# EAGLE design qo-100-opi-control-hat (EAGLE 9.6.1)
CNAME: None; CREVISION: 1; DESIGNER: Joao Silva

## Sheet 1 of 3: SBC
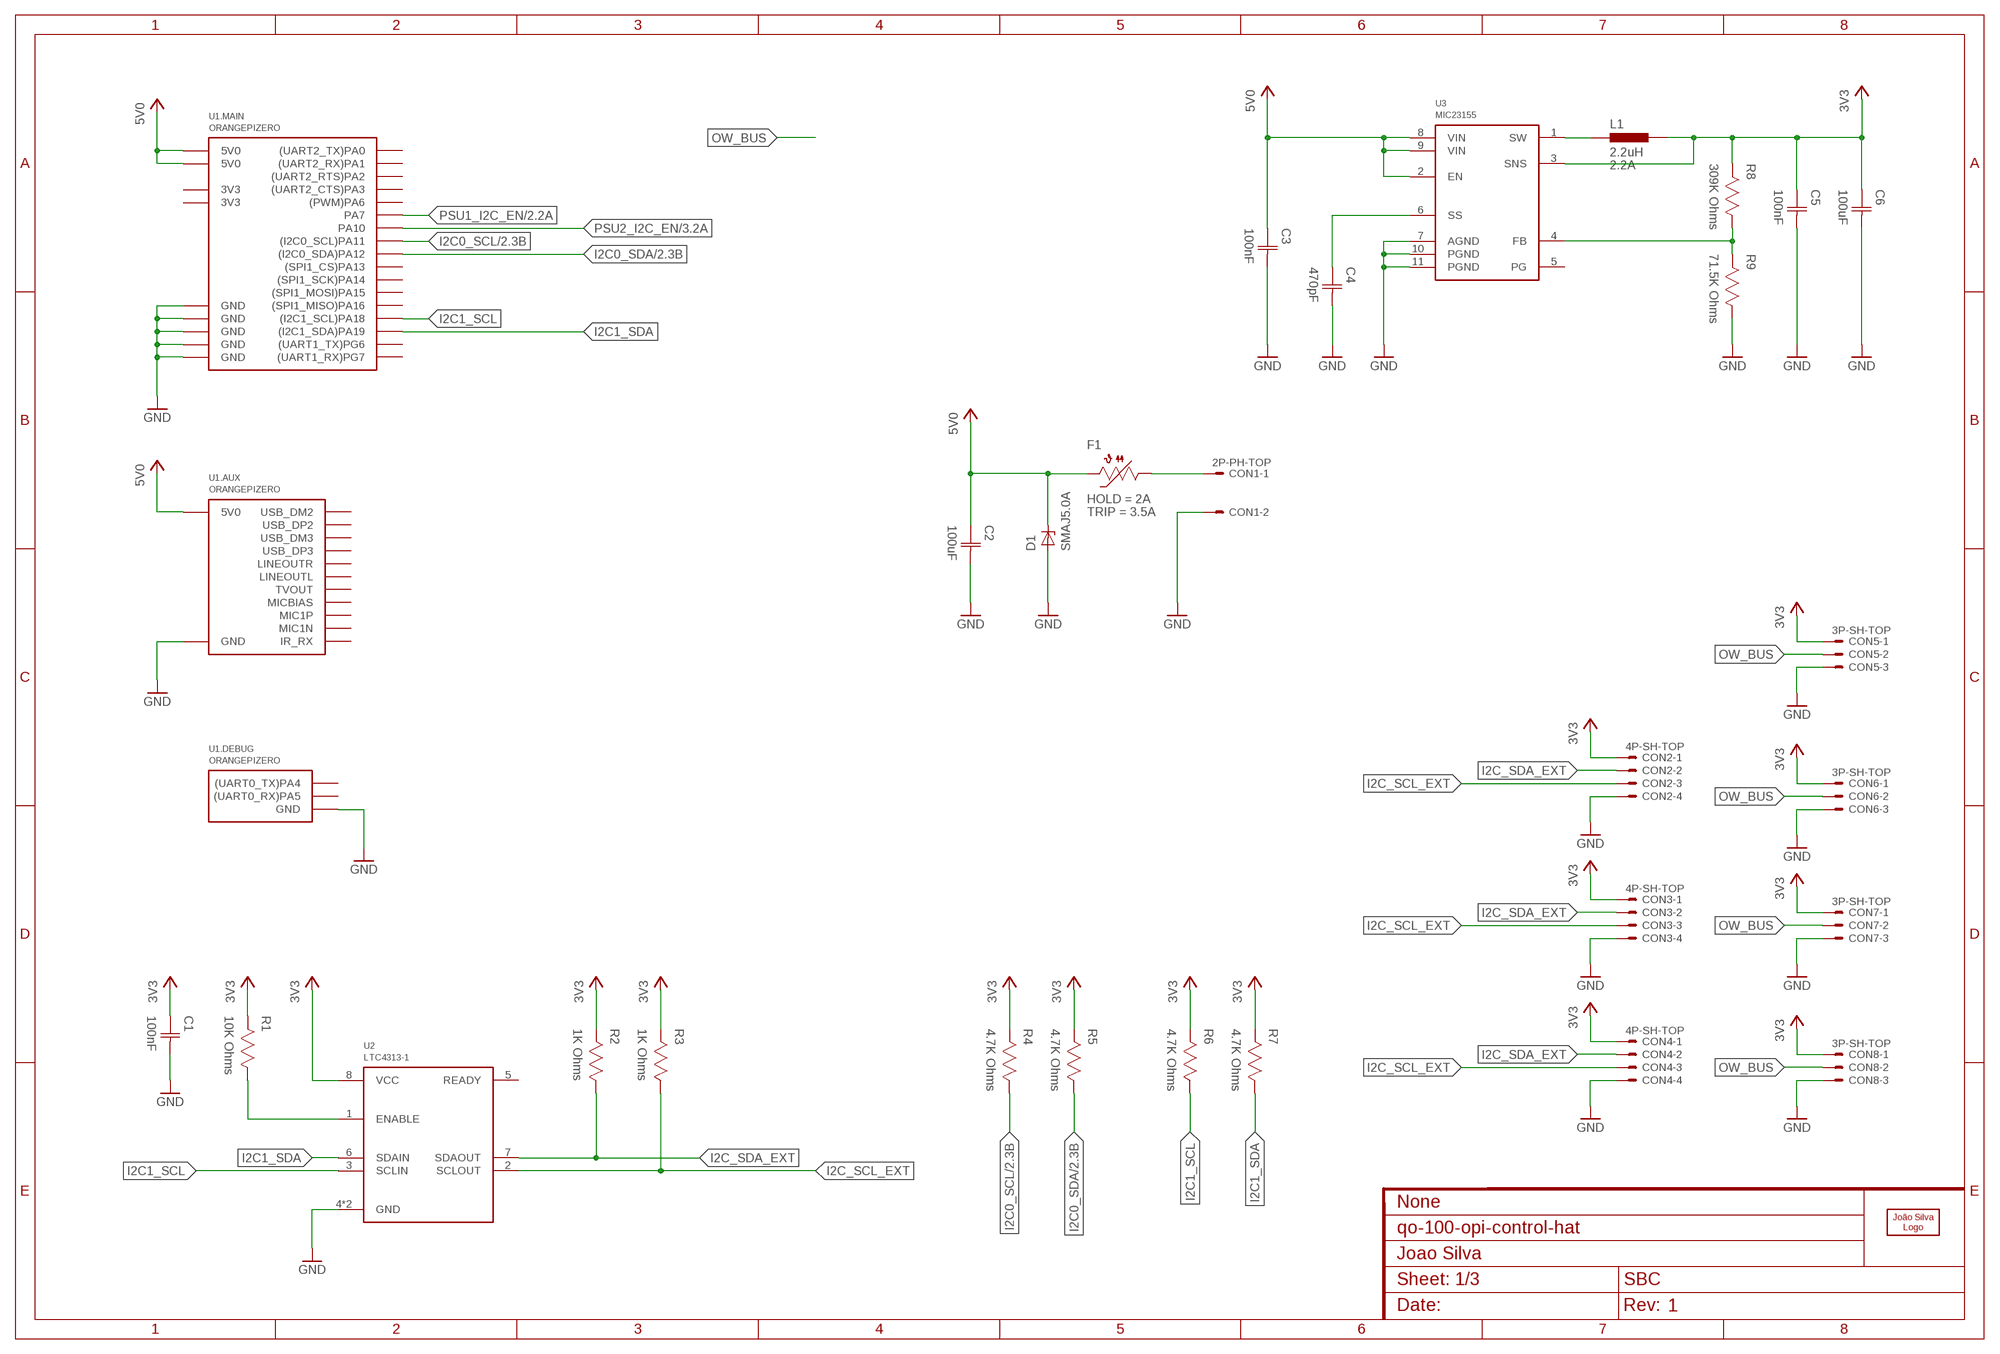
[diagram p0: schematic, sheet 1]

### Parts
C1  100nF  CAPACITOR-0603  [CAP0603]
C2  100uF  CAPACITOR-1206  [CAP1206]
C3  100nF  CAPACITOR-0603  [CAP0603]
C4  470pF  CAPACITOR-0603  [CAP0603]
C5  100nF  CAPACITOR-0603  [CAP0603]
C6  100uF  CAPACITOR-1206  [CAP1206]
CON1  2P-PH-TOP  [PH-02-TOP]
CON2  4P-SH-TOP  [SH-04-TOP]
CON3  4P-SH-TOP  [SH-04-TOP]
CON4  4P-SH-TOP  [SH-04-TOP]
CON5  3P-SH-TOP  [SH-03-TOP]
CON6  3P-SH-TOP  [SH-03-TOP]
CON7  3P-SH-TOP  [SH-03-TOP]
CON8  3P-SH-TOP  [SH-03-TOP]
D1  SMAJ5.0A  [DO214AC]
F1  PTC1206  [1206]
L1  2.2uH  INDUCTOR-2.5X2X1.2MM  [IND2520]
LOGO1  JS-5MM  [JS_5MM]
R1  10K Ohms  RESISTOR-0603  [RES0603]
R2  1K Ohms  RESISTOR-0603  [RES0603]
R3  1K Ohms  RESISTOR-0603  [RES0603]
R4  4.7K Ohms  RESISTOR-0603  [RES0603]
R5  4.7K Ohms  RESISTOR-0603  [RES0603]
R6  4.7K Ohms  RESISTOR-0603  [RES0603]
R7  4.7K Ohms  RESISTOR-0603  [RES0603]
R8  309K Ohms  RESISTOR-0603  [RES0603]
R9  71.5K Ohms  RESISTOR-0603  [RES0603]
U1  ORANGEPIZERO  [ORANGEPIZERO]
U2  LTC4313-1  [DFN8]
U3  MIC23155  [DFN10]

### Nets
3V3: C1.1(C1) C5.1(C1) C6.1(C1) CON2.1 CON3.1 CON4.1 CON5.1 CON6.1 CON7.1 CON8.1 L1.2 R1.2 R2.2 R3.2 R4.2 R5.2 R6.2 R7.2 R8.2 U2.8(VCC) U3.3(SNS) ; also sheet 2,3
3V3_FB: R8.1 R9.2 U3.4(FB)
3V3_SOFTSTART: C4.1(C1) U3.6(SS)
3V3_SW: L1.1 U3.1(SW)
5V0: C2.1(C1) C3.1(C1) D1.C F1.2 U1.MH$2(.MAIN:5V0) U1.MH$4(.MAIN:5V0) U1.SH$1(.AUX:5V0) U3.2(EN) U3.8(VIN) U3.9(VIN)
GND: C1.2(C2) C2.2(C2) C3.2(C2) C4.2(C2) C5.2(C2) C6.2(C2) CON1.2 CON2.4 CON3.4 CON4.4 CON5.3 CON6.3 CON7.3 CON8.3 D1.A R9.1 U1.DBG$1(.DEBUG:GND) U1.MH$6(.MAIN:GND) U1.MH$9(.MAIN:GND) U1.MH$14(.MAIN:GND) U1.MH$20(.MAIN:GND) U1.MH$25(.MAIN:GND) U1.SH$2(.AUX:GND) U2.4(GND) U2.9(GND) U3.7(AGND) U3.10(PGND) U3.11(PGND) ; also sheet 2,3
I2C0_SCL: R4.1 U1.MH$5(.MAIN:(I2C0_SCL)PA11) ; also sheet 2,3
I2C0_SDA: R5.1 U1.MH$3(.MAIN:(I2C0_SDA)PA12) ; also sheet 2,3
I2C1_SCL: R6.1 U1.MH$18(.MAIN:(I2C1_SCL)PA18) U2.3(SCLIN)
I2C1_SDA: R7.1 U1.MH$16(.MAIN:(I2C1_SDA)PA19) U2.6(SDAIN)
I2C_SCL_EXT: CON2.3 CON3.3 CON4.3 R3.1 U2.2(SCLOUT)
I2C_SDA_EXT: CON2.2 CON3.2 CON4.2 R2.1 U2.7(SDAOUT)
N$12: CON1.1 F1.1
N$13: R1.1 U2.1(ENABLE)
OW_BUS: CON5.2 CON6.2 CON7.2 CON8.2
PSU1_I2C_EN: U1.MH$12(.MAIN:PA7) ; also sheet 2
PSU2_I2C_EN: U1.MH$26(.MAIN:PA10) ; also sheet 3
Unconnected: U1.DBG$2(.DEBUG:(UART0_RX)PA5) U1.DBG$3(.DEBUG:(UART0_TX)PA4) U1.MH$1(.MAIN:3V3) U1.MH$7(.MAIN:(PWM)PA6) U1.MH$8(.MAIN:(UART1_TX)PG6) U1.MH$10(.MAIN:(UART1_RX)PG7) U1.MH$11(.MAIN:(UART2_RX)PA1) U1.MH$13(.MAIN:(UART2_TX)PA0) U1.MH$15(.MAIN:(UART2_CTS)PA3) U1.MH$17(.MAIN:3V3) U1.MH$19(.MAIN:(SPI1_MOSI)PA15) U1.MH$21(.MAIN:(SPI1_MISO)PA16) U1.MH$22(.MAIN:(UART2_RTS)PA2) U1.MH$23(.MAIN:(SPI1_SCK)PA14) U1.MH$24(.MAIN:(SPI1_CS)PA13) U1.SH$3(.AUX:USB_DM2) U1.SH$4(.AUX:USB_DP2) U1.SH$5(.AUX:USB_DM3) U1.SH$6(.AUX:USB_DP3) U1.SH$7(.AUX:LINEOUTR) U1.SH$8(.AUX:LINEOUTL) U1.SH$9(.AUX:TVOUT) U1.SH$10(.AUX:MICBIAS) U1.SH$11(.AUX:MIC1P) U1.SH$12(.AUX:MIC1N) U1.SH$13(.AUX:IR_RX) U2.5(READY) U3.5(PG)

## Sheet 2 of 3: PSU #1 Interface
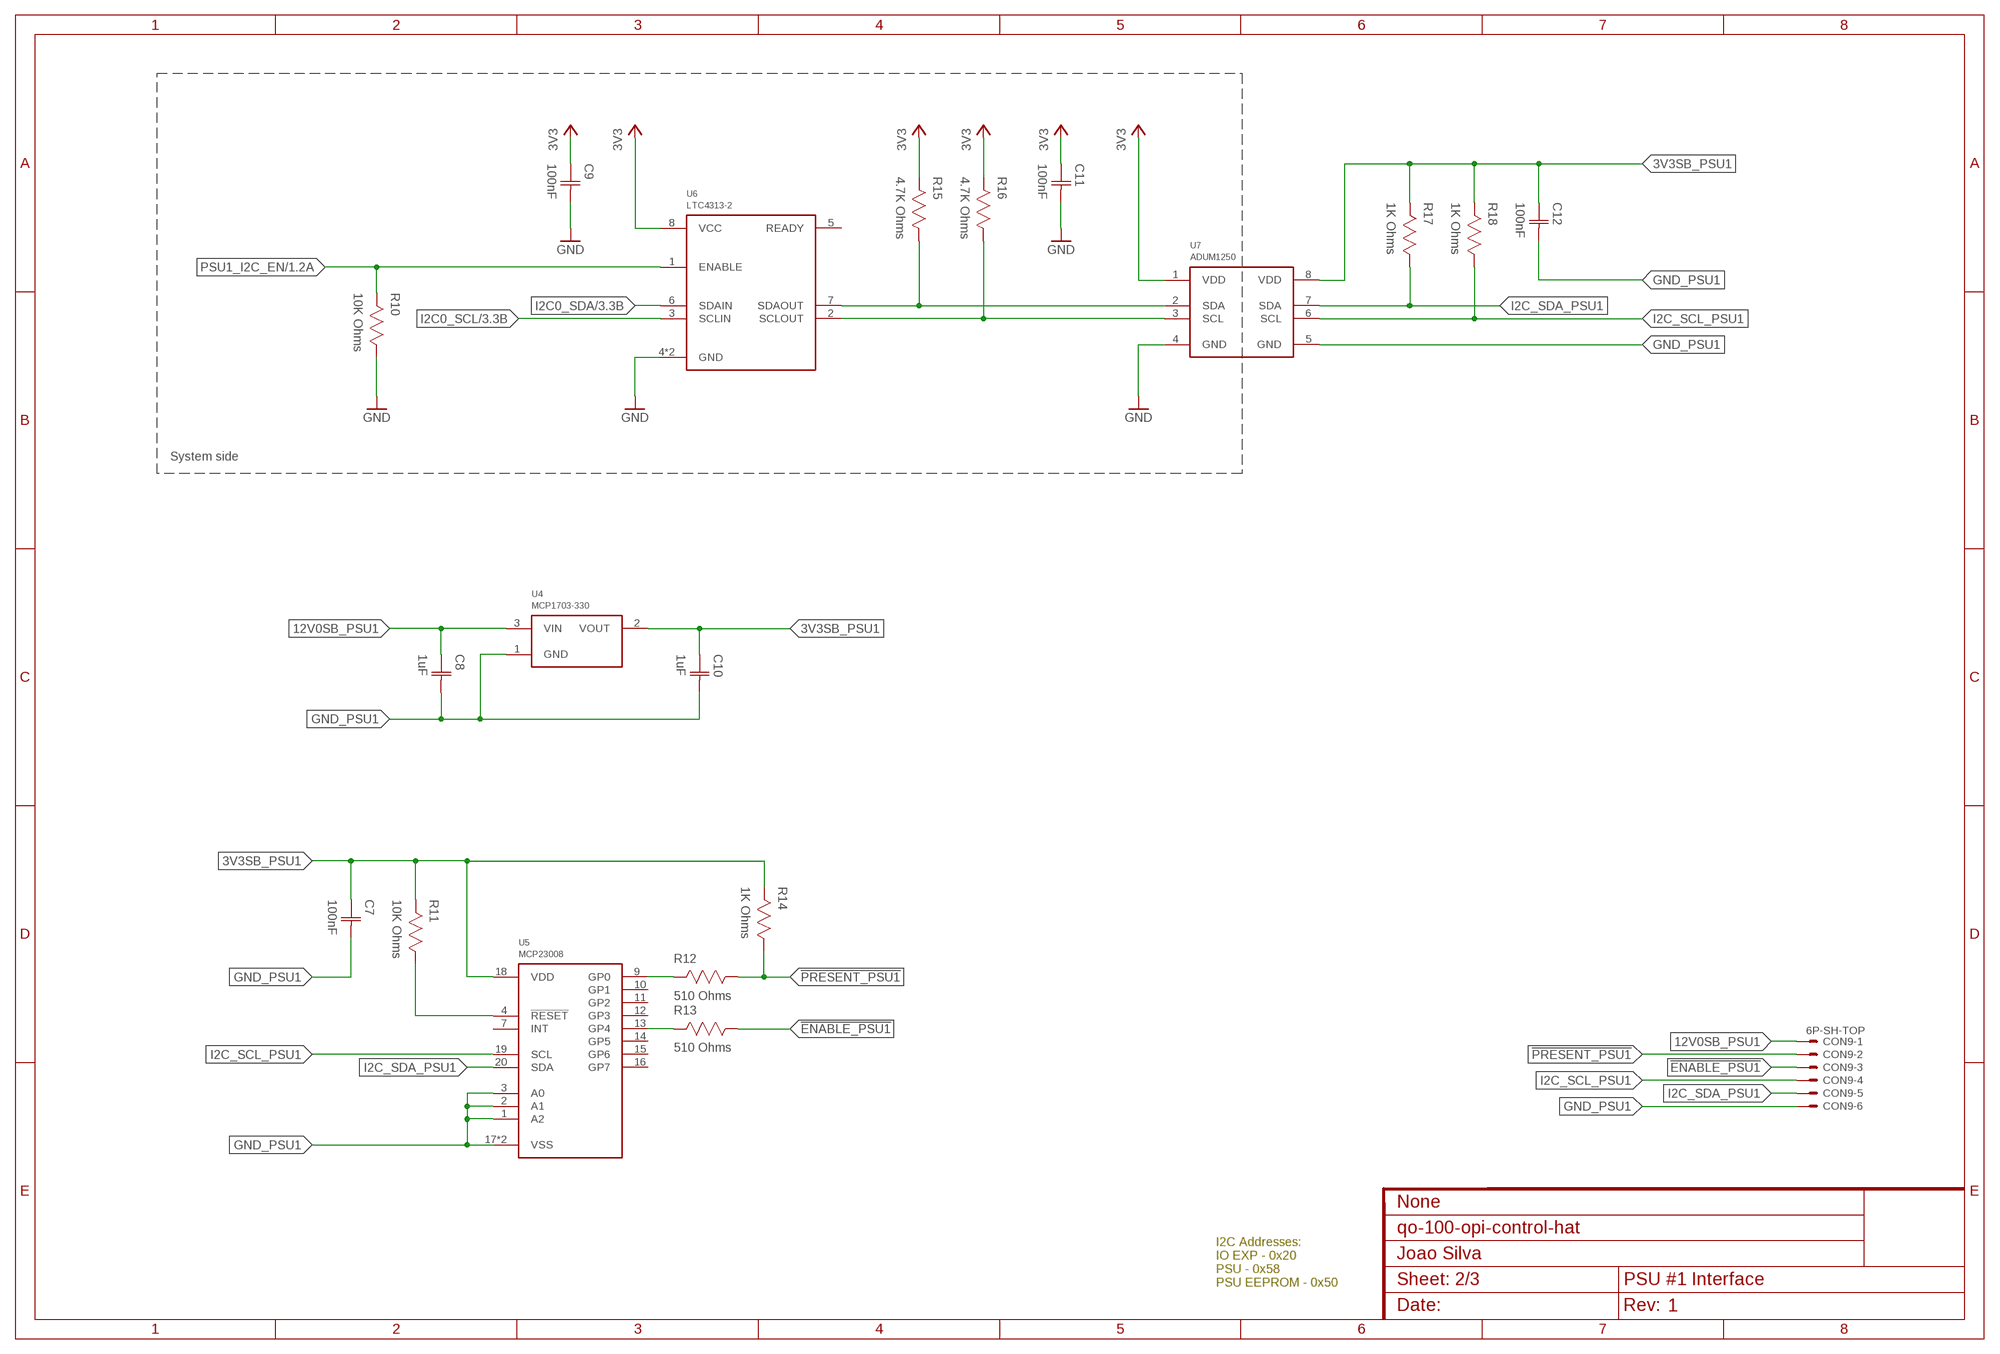
[diagram p1: schematic, sheet 2]

### Parts
C7  100nF  CAPACITOR-0603  [CAP0603]
C8  1uF  CAPACITOR-0603  [CAP0603]
C9  100nF  CAPACITOR-0603  [CAP0603]
C10  1uF  CAPACITOR-0603  [CAP0603]
C11  100nF  CAPACITOR-0603  [CAP0603]
C12  100nF  CAPACITOR-0603  [CAP0603]
CON9  6P-SH-TOP  [SH-06-TOP]
R10  10K Ohms  RESISTOR-0603  [RES0603]
R11  10K Ohms  RESISTOR-0603  [RES0603]
R12  510 Ohms  RESISTOR-0603  [RES0603]
R13  510 Ohms  RESISTOR-0603  [RES0603]
R14  1K Ohms  RESISTOR-0603  [RES0603]
R15  4.7K Ohms  RESISTOR-0603  [RES0603]
R16  4.7K Ohms  RESISTOR-0603  [RES0603]
R17  1K Ohms  RESISTOR-0603  [RES0603]
R18  1K Ohms  RESISTOR-0603  [RES0603]
U4  MCP1703-330  [SOT23]
U5  MCP23008  [QFN20]
U6  LTC4313-2  [DFN8]
U7  ADUM1250  [SOIC8]

### Nets
3V3: C9.1(C1) C11.1(C1) R15.2 R16.2 U6.8(VCC) U7.1(VDD) ; also sheet 1,3
3V3SB_PSU1: C7.1(C1) C10.1(C1) C12.1(C1) R11.2 R14.2 R17.2 R18.2 U4.2(VOUT) U5.18(VDD) U7.8(VDD)
12V0SB_PSU1: C8.1(C1) CON9.1 U4.3(VIN)
!ENABLE_PSU1: CON9.3 R13.1
!PRESENT_PSU1: CON9.2 R12.1 R14.1
GND: C9.2(C2) C11.2(C2) R10.1 U6.4(GND) U6.9(GND) U7.4(GND) ; also sheet 1,3
GND_PSU1: C7.2(C2) C8.2(C2) C10.2(C2) C12.2(C2) CON9.6 U4.1(GND) U5.1(A2) U5.2(A1) U5.3(A0) U5.17(VSS) U5.PAD(VSS) U7.5(GND)
I2C0_SCL: U6.3(SCLIN) ; also sheet 1,3
I2C0_SDA: U6.6(SDAIN) ; also sheet 1,3
I2C_SCL_PSU1: CON9.4 R18.1 U5.19(SCL) U7.6(SCL)
I2C_SDA_PSU1: CON9.5 R17.1 U5.20(SDA) U7.7(SDA)
N$1: R16.1 U6.2(SCLOUT) U7.3(SCL)
N$2: R15.1 U6.7(SDAOUT) U7.2(SDA)
N$3: R11.1 U5.4(!RESET)
N$4: R13.2 U5.13(GP4)
N$5: R12.2 U5.9(GP0)
PSU1_I2C_EN: R10.2 U6.1(ENABLE) ; also sheet 1
Unconnected: U5.7(INT) U5.10(GP1) U5.11(GP2) U5.12(GP3) U5.14(GP5) U5.15(GP6) U5.16(GP7) U6.5(READY)

### Notes on the sheet
- System side
- I2C Addresses:
  IO EXP - 0x20
  PSU - 0x58
  PSU EEPROM - 0x50

## Sheet 3 of 3: PSU #2 Interface
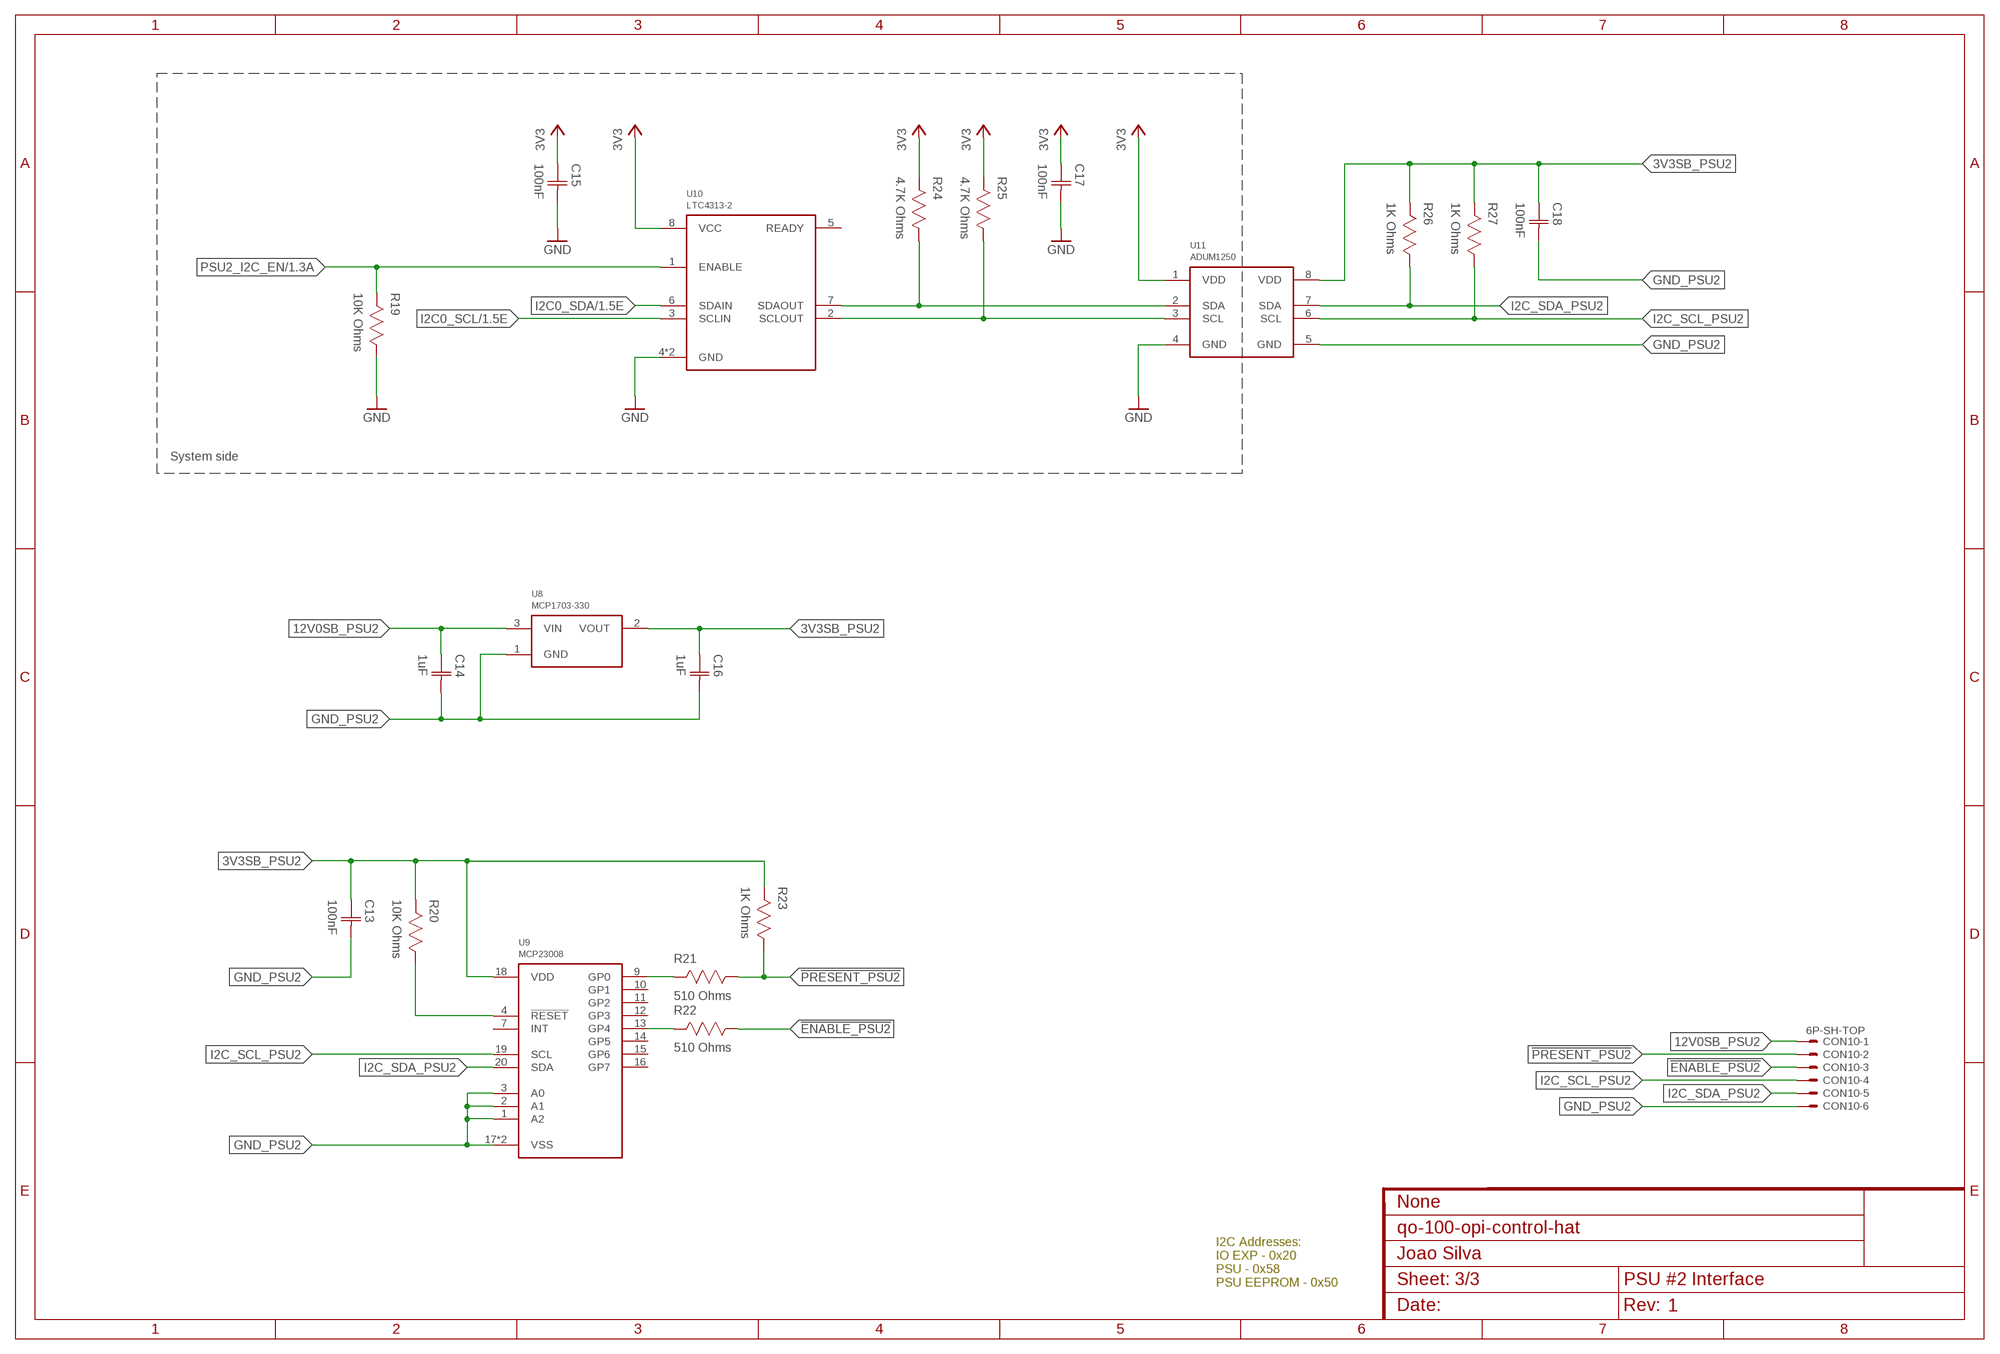
[diagram p2: schematic, sheet 3]

### Parts
C13  100nF  CAPACITOR-0603  [CAP0603]
C14  1uF  CAPACITOR-0603  [CAP0603]
C15  100nF  CAPACITOR-0603  [CAP0603]
C16  1uF  CAPACITOR-0603  [CAP0603]
C17  100nF  CAPACITOR-0603  [CAP0603]
C18  100nF  CAPACITOR-0603  [CAP0603]
CON10  6P-SH-TOP  [SH-06-TOP]
R19  10K Ohms  RESISTOR-0603  [RES0603]
R20  10K Ohms  RESISTOR-0603  [RES0603]
R21  510 Ohms  RESISTOR-0603  [RES0603]
R22  510 Ohms  RESISTOR-0603  [RES0603]
R23  1K Ohms  RESISTOR-0603  [RES0603]
R24  4.7K Ohms  RESISTOR-0603  [RES0603]
R25  4.7K Ohms  RESISTOR-0603  [RES0603]
R26  1K Ohms  RESISTOR-0603  [RES0603]
R27  1K Ohms  RESISTOR-0603  [RES0603]
U8  MCP1703-330  [SOT23]
U9  MCP23008  [QFN20]
U10  LTC4313-2  [DFN8]
U11  ADUM1250  [SOIC8]

### Nets
3V3: C15.1(C1) C17.1(C1) R24.2 R25.2 U10.8(VCC) U11.1(VDD) ; also sheet 1,2
3V3SB_PSU2: C13.1(C1) C16.1(C1) C18.1(C1) R20.2 R23.2 R26.2 R27.2 U8.2(VOUT) U9.18(VDD) U11.8(VDD)
12V0SB_PSU2: C14.1(C1) CON10.1 U8.3(VIN)
!ENABLE_PSU2: CON10.3 R22.1
!PRESENT_PSU2: CON10.2 R21.1 R23.1
GND: C15.2(C2) C17.2(C2) R19.1 U10.4(GND) U10.9(GND) U11.4(GND) ; also sheet 1,2
GND_PSU2: C13.2(C2) C14.2(C2) C16.2(C2) C18.2(C2) CON10.6 U8.1(GND) U9.1(A2) U9.2(A1) U9.3(A0) U9.17(VSS) U9.PAD(VSS) U11.5(GND)
I2C0_SCL: U10.3(SCLIN) ; also sheet 1,2
I2C0_SDA: U10.6(SDAIN) ; also sheet 1,2
I2C_SCL_PSU2: CON10.4 R27.1 U9.19(SCL) U11.6(SCL)
I2C_SDA_PSU2: CON10.5 R26.1 U9.20(SDA) U11.7(SDA)
N$6: R25.1 U10.2(SCLOUT) U11.3(SCL)
N$7: R24.1 U10.7(SDAOUT) U11.2(SDA)
N$8: R20.1 U9.4(!RESET)
N$9: R22.2 U9.13(GP4)
N$10: R21.2 U9.9(GP0)
PSU2_I2C_EN: R19.2 U10.1(ENABLE) ; also sheet 1
Unconnected: U9.7(INT) U9.10(GP1) U9.11(GP2) U9.12(GP3) U9.14(GP5) U9.15(GP6) U9.16(GP7) U10.5(READY)

### Notes on the sheet
- System side
- I2C Addresses:
  IO EXP - 0x20
  PSU - 0x58
  PSU EEPROM - 0x50

## Library data of the parts
C1-C18 = Capacitor:CAPACITOR
CON1 = JST:2P: Disconnectable Crimp style connector, 1.0mm pitch 2 contacts
CON2-CON4 = JST:4P: Disconnectable Crimp style connector, 1.0mm pitch 4 contacts
CON5-CON8 = JST:3P: Disconnectable Crimp style connector, 1.0mm pitch 3 contacts
CON9 CON10 = JST:6P: Disconnectable Crimp style connector, 1.0mm pitch 6 contacts
D1 = TVS:SMAJ*A: SMAJ Series TVS Diodes Source: http://www.littelfuse.com/~/media/electronics/datasheets/tvs_diodes/littelfuse_tvs_diode_smaj_datasheet.pdf.pdf; MF: Littelfuse; MPN: SMAJ5.0A; OC_FARNELL: 1827607; OC_NEWARK: 71J2029
F1 = Fuses:PTC; HOLD: 2A; TRIP: 3.5A
L1 = Inductor:INDUCTOR; CURRENT: 2.2A; OCLCSC: C375952
LOGO1 = Silkscreen:JS
R1-R27 = Resistor:RESISTOR
U1 = SBC:ORANGEPIZERO
U2 U6 U10 = Analog Devices:LTC4313-*
U3 = Microchip:MIC23155
U4 U8 = Microchip:MCP1703-*
U5 U9 = Microchip:MCP23008
U7 U11 = Analog Devices:ADUM1250

## Board
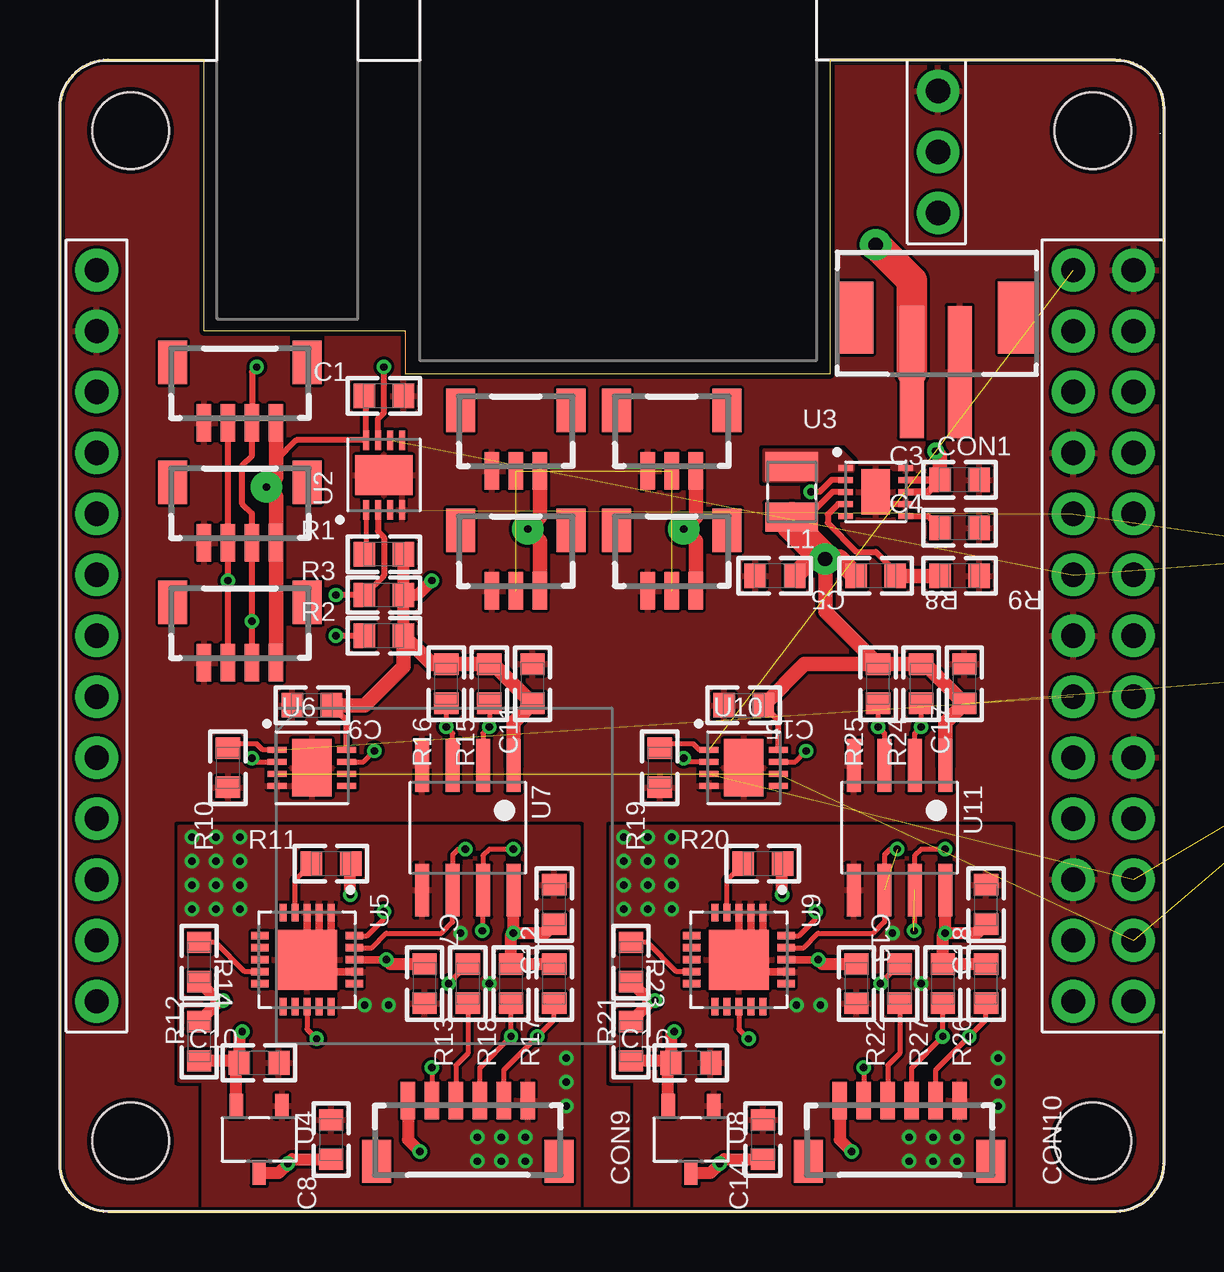
[diagram p3: board, top side]
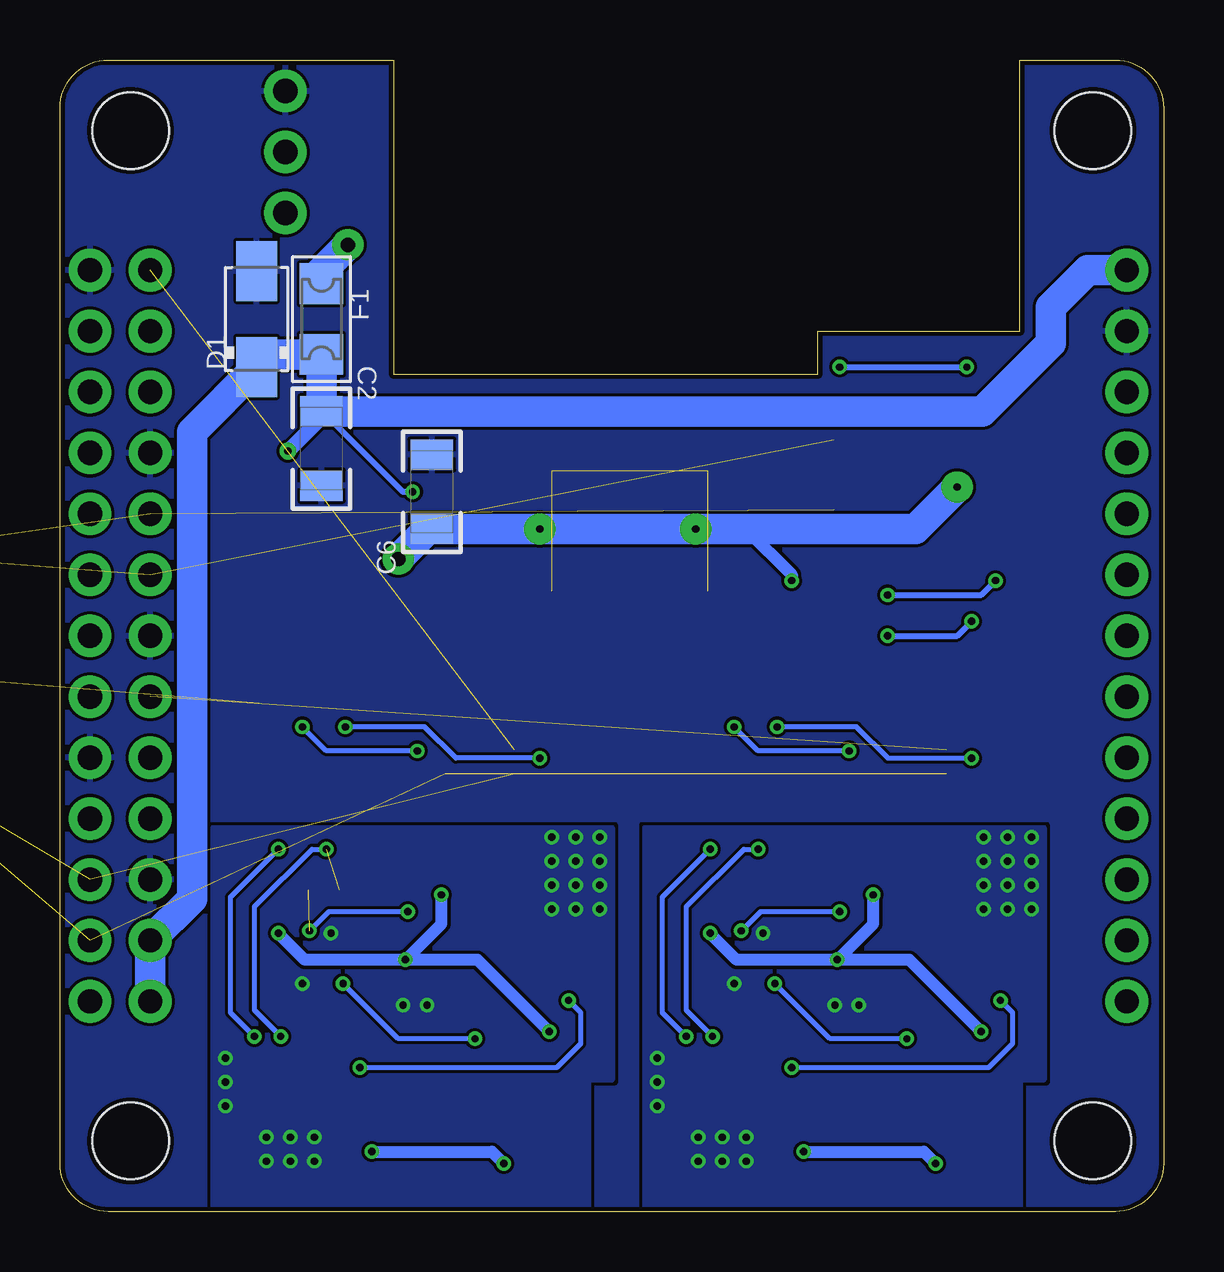
[diagram p4: board, bottom side, seen from below]

Size 46 x 48 mm. Coordinates in mm from the lower left corner, seen from the top.
Outline: 0,46 0,2 arc90 2,0 44,0 arc90 46,2 46,46 arc90 44,48 32.1,48 32.1,34.9 14.4,34.9 14.4,36.7 6,36.7 6,48 2,48 arc90 0,46
Copper layers (1*16): Top 0.035mm / dielectric 1.6mm / Bottom 0.035mm
Design rules "jlcpcb_2layer": minimum track width 5mil, minimum drill 0.3mm, track to track 5mil, track to pad 5mil, pad to pad 5mil, via to via 5mil, smd to smd 5mil, copper to edge 0.2mm, drill to drill 5mil, minimum pad ring 3mil, minimum via ring 3mil, stop-mask expansion 0.075mm, vias tented up to drill 10mm, thermal gap 5mil
tKeepout: area 0.4,0.4 to 5.4,5.4; area 40.6,0.4 to 45.6,5.4; area 0.4,42.6 to 5.4,47.6; area 40.6,42.6 to 45.6,47.6

### Footprints (pad centres in the part's own frame; a part is rotated, then mirrored left to right if it is on the bottom)
CAP0603 = smd 0.889 x 1.016: 1 -0.819,0; 2 0.819,0
CAP1206 = smd 1.27 x 1.778: 1 -1.549,0; 2 1.549,0
PH-02-TOP = smd 1 x 5.5: 1 -1,-2; 2 1,-2 | smd 1.6 x 3: P$1 -3.4,0.27; P$2 3.4,0.27
SH-04-TOP = smd 0.6 x 1.55: 1 1.5,-1.625; 2 0.5,-1.625; 3 -0.5,-1.625; 4 -1.5,-1.625 | smd 1.2 x 1.8: FIT@1 2.8,0.9; FIT@2 -2.8,0.9
SH-03-TOP = smd 0.6 x 1.55: 1 1,-1.625; 2 0,-1.625; 3 -1,-1.625 | smd 1.2 x 1.8: FIT@1 2.3,0.9; FIT@2 -2.3,0.9
SH-06-TOP = smd 0.6 x 1.55: 1 2.5,-1.625; 2 1.5,-1.625; 3 0.5,-1.625; 4 -0.5,-1.625; 5 -1.5,-1.625; 6 -2.5,-1.625 | smd 1.2 x 1.8: FIT@1 3.8,0.9; FIT@2 -3.8,0.9
DO214AC = smd 2.5 x 1.7: A 2,0; C -2,0
1206 = smd 1.7 x 1.803: 1 -1.472,0; 2 1.472,0
IND2520 = smd 2.2 x 1.2: 1 0,-1.05; 2 0,1.05
RES0603 = smd 0.889 x 1.016: 1 -0.819,0; 2 0.819,0
ORANGEPIZERO = drill 1.016 pad 1.778: DBG$1 13.601,22.704; DBG$2 13.601,20.162; DBG$3 13.601,17.624; MH$1 21.75,-15.24; MH$2 19.24,-15.24; MH$3 21.75,-12.7; MH$4 19.24,-12.7; MH$5 21.75,-10.16; MH$6 19.24,-10.16; MH$7 21.75,-7.62; MH$8 19.24,-7.62; MH$9 21.75,-5.08; MH$10 19.24,-5.08; MH$11 21.75,-2.54; MH$12 19.24,-2.54; MH$13 21.75,0; MH$14 19.24,0; MH$15 21.75,2.54; MH$16 19.24,2.54; MH$17 21.75,5.08; MH$18 19.24,5.08; MH$19 21.75,7.62; MH$20 19.24,7.62; MH$21 21.75,10.16; MH$22 19.24,10.16; MH$23 21.75,12.7; MH$24 19.24,12.7; MH$25 21.75,15.24; MH$26 19.24,15.24; SH$1 -21.469,15.24; SH$2 -21.469,12.7; SH$3 -21.469,10.16; SH$4 -21.469,7.62; SH$5 -21.469,5.08; SH$6 -21.469,2.54; SH$7 -21.469,0; SH$8 -21.469,-2.54; SH$9 -21.469,-5.08; SH$10 -21.469,-7.62; SH$11 -21.469,-10.16; SH$12 -21.469,-12.7; SH$13 -21.469,-15.24 | hole 3.2: -20.055,-21.055; 20.055,-21.055; -20.055,21.055; 20.055,21.055
DFN8 = smd 0.8 x 0.25: 1 -1.45,0.75; 2 -1.45,0.25; 3 -1.45,-0.25; 4 -1.45,-0.75; 5 1.45,-0.75; 6 1.45,-0.25; 7 1.45,0.25; 8 1.45,0.75 | smd 1.65 x 2.38: 9 0,0
DFN10 = smd 0.6 x 0.25: 1 -1.25,1; 2 -1.25,0.5; 3 -1.25,0; 4 -1.25,-0.5; 5 -1.25,-1; 6 1.25,-1; 7 1.25,-0.5; 8 1.25,0; 9 1.25,0.5; 10 1.25,1 | smd 1.2 x 1.9: 11 0,0
SOT23 = smd 1 x 0.55: 1 -1.4,0.95; 2 -1.4,-0.95; 3 1.394,0
QFN20 = smd 0.73 x 0.3: 1 -1.965,1; 2 -1.965,0.5; 3 -1.965,0; 4 -1.965,-0.5; 5 -1.965,-1; 11 1.965,-1; 12 1.965,-0.5; 13 1.965,0; 14 1.965,0.5; 15 1.965,1 | smd 0.3 x 0.73: 6 -1,-1.965; 7 -0.5,-1.965; 8 0,-1.965; 9 0.5,-1.965; 10 1,-1.965; 16 1,1.965; 17 0.5,1.965; 18 0,1.965; 19 -0.5,1.965; 20 -1,1.965 | smd 2.5 x 2.5: PAD 0,0
SOIC8 = smd 0.6 x 2.2: 1 -1.905,-2.6; 2 -0.635,-2.6; 3 0.635,-2.6; 4 1.905,-2.6; 5 1.905,2.6; 6 0.635,2.6; 7 -0.635,2.6; 8 -1.905,2.6

### Placement (x,y rotation side)
C1  13.5,34 0 top
C2  35.1,31.8 270 bottom
C3  37.5,30.5 0 top
C4  37.5,28.5 0 top
C5  29.8,26.5 180 top
C6  30.5,30 90 bottom
C7  15.2,9.5 270 top
C8  11.3,3 90 top
C9  10.5,21.1 180 top
C10  8.3,6.2 0 top
C11  19.7,22 90 top
C12  20.6,12.8 90 top
C13  33.2,9.5 270 top
C14  29.3,3 90 top
C15  28.5,21.1 180 top
C16  26.3,6.2 0 top
C17  37.7,22 90 top
C18  38.6,12.8 90 top
CON1  36.5,37 0 top
CON2  7.5,34.5 0 top
CON3  7.5,29.5 0 top
CON4  7.5,24.5 0 top
CON5  19,32.5 0 top
CON6  25.5,32.5 0 top
CON7  19,27.5 0 top
CON8  25.5,27.5 0 top
CON9  17,3 180 top
CON10  35,3 180 top
D1  37.8,37.2 90 bottom
F1  35.1,37.2 270 bottom
L1  30.5,30 180 top
LOGO1  60.03,40.82 0 top  (outside the outline)
R1  13.5,27.4 0 top
R2  13.5,24 0 top
R3  13.5,25.7 0 top
R4  61.4,23.2 0 top  (outside the outline)
R5  61.4,24.8 0 top  (outside the outline)
R6  61.6,26.4 0 top  (outside the outline)
R7  62,28 0 top  (outside the outline)
R8  34,26.5 180 top
R9  37.5,26.5 180 top
R10  7,18.5 90 top
R11  11.3,14.5 0 top
R12  5.8,10.4 90 top
R13  17,9.5 90 top
R14  5.8,7.1 270 top
R15  17.9,22 90 top
R16  16.1,22 90 top
R17  20.6,9.5 90 top
R18  18.8,9.5 90 top
R19  25,18.5 90 top
R20  29.3,14.5 0 top
R21  23.8,10.4 90 top
R22  35,9.5 90 top
R23  23.8,7.1 270 top
R24  35.9,22 90 top
R25  34.1,22 90 top
R26  38.6,9.5 90 top
R27  36.8,9.5 90 top
U1  23,24 0 top
U2  13.5,30.7 90 top
U3  34,30 0 top
U4  8.3,3 270 top
U5  10.3,10.5 270 top
U6  10.5,18.5 0 top
U7  17,16 180 top
U8  26.3,3 270 top
U9  28.3,10.5 270 top
U10  28.5,18.5 0 top
U11  35,16 180 top

### Tracks (layer width: path | path; a pad name or v marks a point on that pad's centre or on a via)
3V3  (via drill 0.3, 0.3 pad 1.3, 0.6 pad 1.3)  (4 unrouted)
  Top 0.254: C1.1 12.75,33.93 U2.8 9.85,32.15 9,31.3 | U3.3 32.2,30 31.15,28.95 L1.2 | U6.8 11.95,20.47 C9.1 | U10.8 29.95,20.47 C15.1
  Top 0.508: v15.5,26.3 14.9,25.7 R3.2 | R3.2 R1.2 | R2.2 R3.2
  Top 0.61: CON2.1 9,31.3 9,30.6 v8.6,30.2 9,29.8 CON3.1 CON4.1 | CON7.1 20,27.95 v19.5,28.45 20,28.95 CON5.1 | CON8.1 26.5,27.95 v26,28.45 26.5,28.95 CON6.1 | R25.2 31.9,25.02 v31.9,27.2 | R25.2 R24.2 36.06,22.82 C17.1 36.91,20.39 U11.1 | C15.1 31.04,22.82 R25.2 | U7.1 18.91,20.39 C11.1 18.06,22.82 R15.2 R16.2 15.5,22.82 R2.2 14.32,22.72 12.7,21.1 C9.1
  Top 0.813: C5.1 31.32,27.2 v31.9,27.2 32.48,27.2 R8.2
  Top 1.27: L1.2 30.5,28.6 v31.9,27.2
  Bottom 0.508: 17.4,28.45 15.5,26.55 v15.5,26.3
  Bottom 1.27: v31.9,27.2 30.65,28.45 C6.1 v26,28.45 v19.5,28.45 17.4,28.45 10.35,28.45 v8.6,30.2
3V3_FB
  Top 0.254: U3.4 32.44,29.5 32,29.06 32,28.71 33.21,27.5 34,27.5 34.82,26.68 R8.1
  Top 0.61: R9.2 R8.1
3V3_SOFTSTART
  Top 0.254: U3.6 36.18,29 C4.1
3V3_SW
  pour Top (no thermals): 29.4,31.7 32.5,31.7 33,31.2 33,30.9 32.1,30.9 31.7,30.5 31.4,30.5 29.4,30.5
3V3SB_PSU1  (via drill 0.3)
  Top 0.305: U5.18 v13.6,10.5
  Top 0.508: U4.2 7.35,6.07 C10.1 | C10.1 7.4,6.28 R14.2 | C10.1 7.48,7.38 v7.6,7.5 | v13.6,10.5 13.78,10.32 C7.1 | v18.9,11.6 v18.91,11.61 U7.8 | C12.1 20.22,11.6 v18.9,11.6 | v18.9,11.6 18.8,11.5 R18.2 R17.2 | v12.1,13.2 12.1,14.48 R11.2
  Bottom 0.508: v7.6,7.5 10.6,10.5 v13.6,10.5 | v13.6,10.5 17.8,10.5 v18.9,11.6 | v13.6,10.5 12.1,12 v12.1,13.2
3V3SB_PSU2  (via drill 0.3)
  Top 0.305: U9.18 v31.6,10.5
  Top 0.508: U8.2 25.35,6.07 C16.1 | C16.1 25.4,6.28 R23.2 | C16.1 25.48,7.38 v25.6,7.5 | v31.6,10.5 31.78,10.32 C13.1 | v36.9,11.6 v36.91,11.61 U11.8 | C18.1 38.22,11.6 v36.9,11.6 | v36.9,11.6 36.8,11.5 R27.2 R26.2 | v30.1,13.2 30.1,14.48 R20.2
  Bottom 0.508: v25.6,7.5 28.6,10.5 v31.6,10.5 | v31.6,10.5 35.8,10.5 v36.9,11.6 | v31.6,10.5 30.1,12 v30.1,13.2
5V0  (via drill 0.3, 0.3 pad 0.7)
  Top 0.254: v31.3,30 31.66,30 32.16,30.5 U3.2
  Top 0.305: U3.9 C3.1 36.18,30 U3.8
  Top 0.61: C3.1 36.68,31.52 v36.5,31.7
  Bottom 0.254: v31.3,30 31.7,30 35.05,33.35 C2.1
  Bottom 0.61: v36.5,31.7 35.1,33.1 C2.1
  Bottom 1.27: U1.SH$1 3.16,39.24 4.7,37.7 4.7,36.2 7.55,33.35 C2.1 F1.2 37.27,35.73 D1.C 40.5,32.5 40.5,13.04 U1.MH$4 U1.MH$2
12V0SB_PSU1  (via drill 0.3)
  Top 0.508: CON9.1 14.5,3 v15,2.5 | C8.1 9.68,2.18 v9.5,2 9.11,1.61 U4.3
  Bottom 0.508: v15,2.5 10,2.5 v9.5,2
12V0SB_PSU2  (via drill 0.3)
  Top 0.508: CON10.1 32.5,3 v33,2.5 | C14.1 27.68,2.18 v27.5,2 27.11,1.61 U8.3
  Bottom 0.508: v33,2.5 28,2.5 v27.5,2
!ENABLE_PSU1
  Top 0.2: R13.1 17,6.6 16.5,6.1 CON9.3
!ENABLE_PSU2
  Top 0.2: R22.1 35,6.6 34.5,6.1 CON10.3
!PRESENT_PSU1  (via drill 0.3)
  Top 0.2: v15.5,6 CON9.2
  Top 0.508: R12.1 6.58,8.8 v6.8,8.8 6.68,8.8 R14.1
  Bottom 0.2: v6.8,8.8 6.3,8.3 6.3,7 7.3,6 v15.5,6
!PRESENT_PSU2  (via drill 0.3)
  Top 0.2: v33.5,6 CON10.2
  Top 0.508: R21.1 24.58,8.8 v24.8,8.8 24.68,8.8 R23.1
  Bottom 0.2: v24.8,8.8 24.3,8.3 24.3,7 25.3,6 v33.5,6
GND
  Top 0.254: U3.7 34.5,29.5 U3.11
  pour Top (rank 6): -1,49 47,49 47,-1 -1,-1
  pour Bottom (rank 6): -2,50 48,50 48,-2 -2,-2
GND_PSU1  (via drill 0.3)
  Top 0.305: U5.17 10.3,10 U5.PAD | U5.3 U5.PAD | U5.2 10.8,10.5 U5.PAD | U5.1 11.3,10.5 U5.PAD
  other vias: 5.5,15.6 6.5,15.6 7.5,15.6 7.5,14.6 6.5,14.6 5.5,14.6 17.4,3.1 18.4,3.1 19.4,3.1 19.4,2.1 18.4,2.1 17.4,2.1 21.1,4.4 21.1,5.4 21.1,6.4 13.7,8.6 12.7,8.6 16.7,11.6 17.9,9.5 5.5,13.6 6.5,13.6 7.5,13.6 7.5,12.6 6.5,12.6 5.5,12.6
  pour Top: 6,-1 21.6,-1 21.6,16 5,16 5,5.5 6,5.5
  pour Bottom: 6,-1 21.6,-1 21.6,16 5,16 5,5.5 6,5.5
GND_PSU2  (via drill 0.3)
  Top 0.305: U9.17 28.3,10 | U9.3 U9.PAD 28.8,10.5 U9.2 | U9.1 29.3,10.5
  other vias: 23.5,15.6 24.5,15.6 25.5,15.6 25.5,14.6 24.5,14.6 23.5,14.6 35.4,3.1 36.4,3.1 37.4,3.1 37.4,2.1 36.4,2.1 35.4,2.1 39.1,4.4 39.1,5.4 39.1,6.4 31.7,8.6 30.7,8.6 34.7,11.6 35.9,9.5 23.5,13.6 24.5,13.6 25.5,13.6 25.5,12.6 24.5,12.6 23.5,12.6
  pour Top: 24,-1 39.6,-1 39.6,16 23,16 23,5.5 24,5.5
  pour Bottom: 24,-1 39.6,-1 39.6,16 23,16 23,5.5 24,5.5
I2C0_SCL  (3 unrouted)
I2C0_SDA  (3 unrouted)
I2C1_SCL  (2 unrouted)
I2C1_SDA  (2 unrouted)
I2C_SCL_EXT  (via drill 0.3)
  Top 0.254: CON4.3 v7,26.3 CON3.3 CON2.3 | U2.2 13.25,28.35 13.5,28.1 13.5,26.52 R3.1 v11.5,25.7
  Bottom 0.254: v11.5,25.7 7.6,25.7 v7,26.3
I2C_SCL_PSU1  (via drill 0.3)
  Top 0.2: CON9.4 17.5,6 v18.8,7.3 R18.1 | v16.9,15.1 16.6,15.1 16.36,14.87 U7.6 16.36,12.06 15.9,11.6 13.6,11.6 13,11 U5.19
  Bottom 0.2: v16.9,15.1 17.5,15.1 19.9,12.7 19.9,8.4 v18.8,7.3
I2C_SCL_PSU2  (via drill 0.3)  (1 unrouted)
  Top 0.2: CON10.4 35.5,6 v36.8,7.3 R27.1 | v34.9,15.1 34.6,15.1 34.37,14.87 34.37,12.06 33.9,11.6 31.6,11.6 31,11 U9.19
  Bottom 0.2: v34.9,15.1 35.5,15.1 37.9,12.7 37.9,8.4 v36.8,7.3
I2C_SDA_EXT  (via drill 0.3)
  Top 0.254: CON4.2 v8,24.6 CON3.2 8,29.1 7.6,29.5 7.6,31.1 8,31.5 CON2.2 8,35 v8.2,35.2 | U2.7 13.25,33.05 13.5,33.3 v13.5,35.2 | R2.1 v11.5,24
  Bottom 0.254: v13.5,35.2 v8.2,35.2 | v11.5,24 8.6,24 v8,24.6
I2C_SDA_PSU1  (via drill 0.3)
  Top 0.2: CON9.5 18.5,5.9 v19.9,7.3 20.6,8 R17.1 | v18.9,15.1 17.9,15.1 17.64,14.84 U7.7 17.64,11.73 v17.6,11.7 | U5.20 12.8,11.5 13.5,12.2 v13.5,12.5
  Bottom 0.2: v18.9,15.1 20.9,13.1 20.9,8.3 v19.9,7.3 | v13.5,12.5 16.8,12.5 v17.6,11.7
I2C_SDA_PSU2  (via drill 0.3)  (1 unrouted)
  Top 0.2: CON10.5 36.5,5.9 v37.9,7.3 38.6,8 R26.1 | v36.9,15.1 35.9,15.1 35.63,14.84 35.63,11.73 v35.6,11.7 | U9.20 30.8,11.5 31.5,12.2 v31.5,12.5
  Bottom 0.2: v36.9,15.1 38.9,13.1 38.9,8.3 v37.9,7.3 | v31.5,12.5 34.8,12.5 v35.6,11.7
N$1  (via drill 0.3)
  Top 0.2: U7.3 16.36,19.93 v16.1,20.2 R16.1 | v8,18.9 8.15,18.75 U6.2
  Bottom 0.2: v8,18.9 11.5,18.9 12.8,20.2 v16.1,20.2
N$2  (via drill 0.3)
  Top 0.2: U6.7 12.65,18.75 v13.1,19.2 | U7.2 17.64,19.93 v17.9,20.2 R15.1
  Bottom 0.2: v13.1,19.2 16.9,19.2 v17.9,20.2
N$3
  Top 0.2: U5.4 9.8,13.82 R11.1
N$4  (via drill 0.3)
  Top 0.2: U5.13 10.3,7.6 v10.7,7.2 | v16.2,9.5 16.2,9.52 R13.2
  Bottom 0.2: v10.7,7.2 13.9,7.2 v16.2,9.5
N$5
  Top 0.2: U5.9 7.7,10 6.48,11.22 R12.2
N$6  (via drill 0.3)
  Top 0.2: U10.2 26.15,18.75 v26,18.9 | U11.3 34.37,19.93 v34.1,20.2 R25.1
  Bottom 0.2: v26,18.9 29.5,18.9 30.8,20.2 v34.1,20.2
N$7  (via drill 0.3)
  Top 0.2: U10.7 30.65,18.75 v31.1,19.2 | R24.1 v35.9,20.2 35.63,19.93 U11.2
  Bottom 0.2: v31.1,19.2 34.9,19.2 v35.9,20.2
N$8
  Top 0.2: U9.4 27.8,13.82 R20.1
N$9  (via drill 0.3)
  Top 0.2: U9.13 28.3,7.6 v28.7,7.2 | v34.2,9.5 34.2,9.52 R22.2
  Bottom 0.2: v28.7,7.2 31.9,7.2 v34.2,9.5
N$10
  Top 0.2: U9.9 25.7,10 24.48,11.22 R21.2
N$12  (via drill 0.6 pad 1.3)
  Top 1.27: CON1.1 35.5,38.8 v34,40.3
  Bottom 1.27: v34,40.3 35.1,39.2 F1.1
N$13
  Top 0.2: U2.1 12.75,27.47 R1.1
OW_BUS  (3 unrouted)
PSU1_I2C_EN  (1 unrouted)
  Top 0.2: U6.1 8.45,19.25 8.2,19.5 7.18,19.5 R10.2
PSU2_I2C_EN  (1 unrouted)
  Top 0.2: U10.1 26.65,19.25 26.4,19.5 25.18,19.5 R19.2